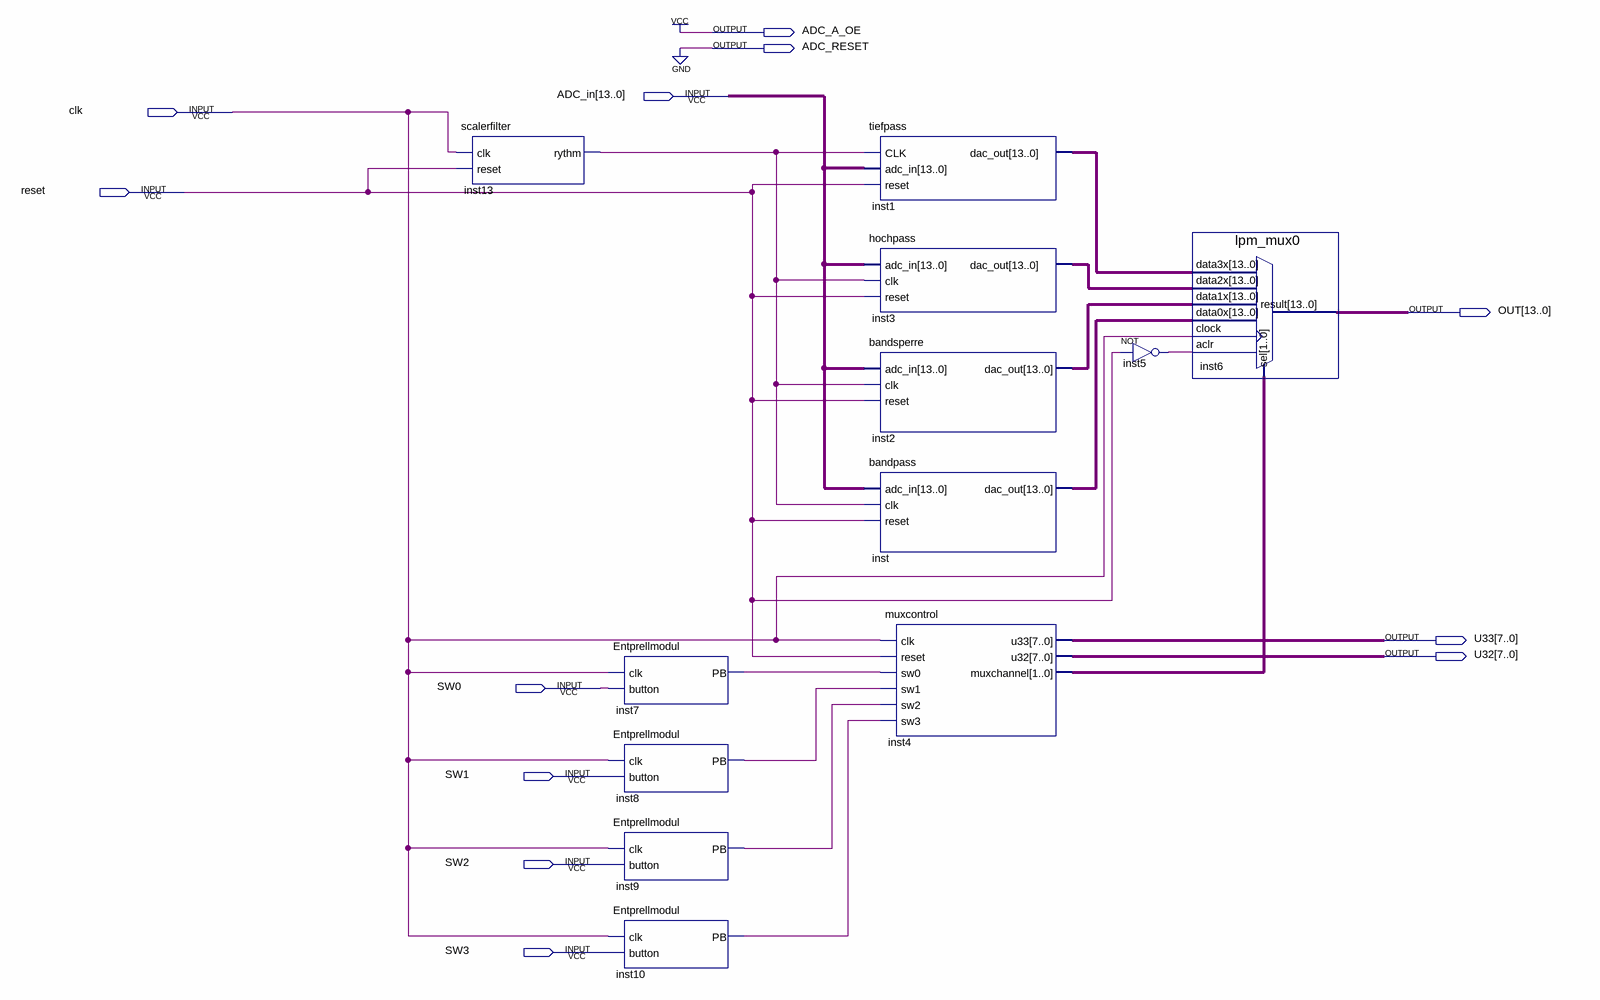
[diagram p0: schematic sheet]
// Quartus schematic AlleFilter.bdf as structural Verilog: 12 symbols, 12 pins
module AlleFilter (
  input  [13:0] ADC_in,
  input  clk,
  input  reset,
  input  SW0,
  input  SW1,
  input  SW2,
  input  SW3,
  output ADC_A_OE,
  output ADC_RESET,
  output [13:0] OUT,
  output [7:0] U33,
  output [7:0] U32
);

  wire inst5_out, inst7_pb, inst8_pb, inst9_pb, inst10_pb, inst13_rythm;
  wire [1:0] inst4_muxchannel;
  wire [13:0] inst1_dac_out, inst2_dac_out, inst3_dac_out, inst_dac_out;

  scalerfilter inst13 (.clk(clk), .reset(reset), .rythm(inst13_rythm));
  Entprellmodul inst7 (.clk(clk), .button(SW0), .PB(inst7_pb));
  Entprellmodul inst8 (.clk(clk), .button(SW1), .PB(inst8_pb));
  Entprellmodul inst9 (.clk(clk), .button(SW2), .PB(inst9_pb));
  Entprellmodul inst10 (.clk(clk), .button(SW3), .PB(inst10_pb));
  tiefpass inst1 (.CLK(inst13_rythm), .adc_in(ADC_in), .reset(reset), .dac_out(inst1_dac_out));
  hochpass inst3 (.adc_in(ADC_in), .clk(inst13_rythm), .reset(reset), .dac_out(inst3_dac_out));
  bandsperre inst2 (.adc_in(ADC_in), .clk(inst13_rythm), .reset(reset), .dac_out(inst2_dac_out));
  bandpass inst (.adc_in(ADC_in), .clk(inst13_rythm), .reset(reset), .dac_out(inst_dac_out));
  muxcontrol inst4 (
    .clk(clk), .reset(reset), .sw0(inst7_pb), .sw1(inst8_pb), .sw2(inst9_pb), .sw3(inst10_pb), .u33(U33),
    .u32(U32), .muxchannel(inst4_muxchannel));
  not inst5 (inst5_out, reset);
  lpm_mux0 inst6 (
    .data3x(inst1_dac_out), .data2x(inst3_dac_out), .data1x(inst2_dac_out), .data0x(inst_dac_out),
    .clock(clk), .aclr(inst5_out), .sel(inst4_muxchannel), .result(OUT));

  assign ADC_A_OE = 1'b1;
  assign ADC_RESET = 1'b0;
endmodule
